# EAGLE design WeatherStation_Rev2 (EAGLE 5.07)
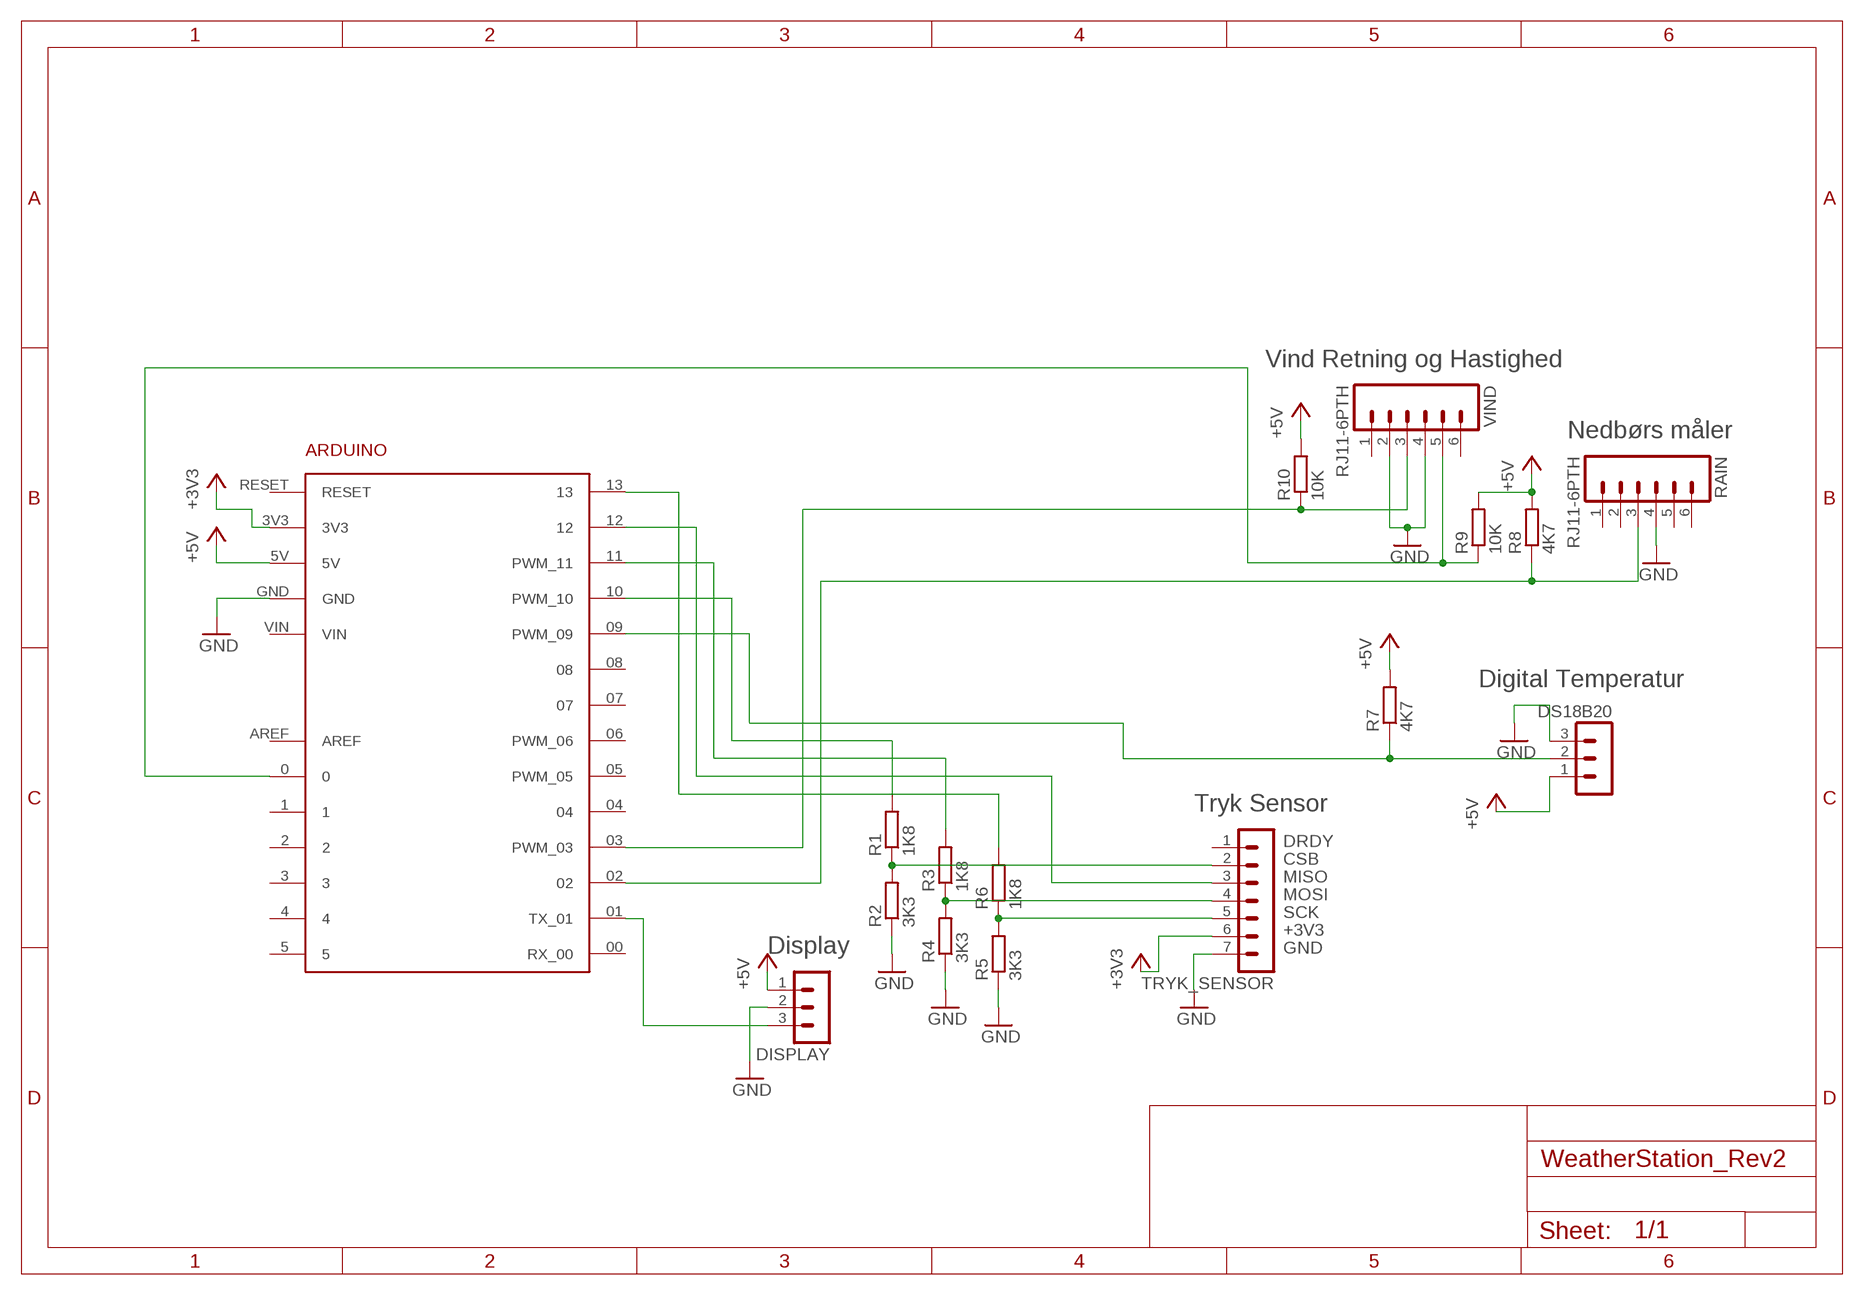
[diagram p0: schematic, sheet 1]

## Parts
ARDUINO1  ARDUINO  [ARDUINO]
DISPLAY  MA03-1  [MA03-1]
DS18B20  MA03-1  [MA03-1]
R1  1K8  R-EU_0207/10  [0207/10]
R2  3K3  R-EU_0207/10  [0207/10]
R3  1K8  R-EU_0207/10  [0207/10]
R4  3K3  R-EU_0207/10  [0207/10]
R5  3K3  R-EU_0207/10  [0207/10]
R6  1K8  R-EU_0207/10  [0207/10]
R7  4K7  R-EU_0207/10  [0207/10]
R8  4K7  R-EU_0207/10  [0207/10]
R9  10K  R-EU_0207/10  [0207/10]
R10  10K  R-EU_0207/10  [0207/10]
RAIN  RJ11-6PTH  [RJ11-6]
TRYK_SENSOR  MA07-1  [MA07-1]
VIND  RJ11-6PTH  [RJ11-6]

## Nets
+3V3: ARDUINO1.3V3 TRYK_SENSOR.6
+5V: ARDUINO1.5V DISPLAY.1 DS18B20.1 R7.2 R8.2 R9.2 R10.2
GND: ARDUINO1.GND DISPLAY.2 DS18B20.3 R2.1 R4.1 R5.1 RAIN.4 TRYK_SENSOR.7 VIND.2 VIND.4
N$1: ARDUINO1.11(PWM_11) R3.2
N$2: R1.1 R2.2 TRYK_SENSOR.2
N$3: ARDUINO1.10(PWM_10) R1.2
N$4: ARDUINO1.12 TRYK_SENSOR.3
N$5: R3.1 R4.2 TRYK_SENSOR.4
N$6: R5.2 R6.1 TRYK_SENSOR.5
N$7: ARDUINO1.13 R6.2
N$8: ARDUINO1.02 R8.1 RAIN.3
N$9: ARDUINO1.09(PWM_09) DS18B20.2 R7.1
N$10: ARDUINO1.0 R9.1 VIND.5
N$11: ARDUINO1.01(TX_01) DISPLAY.3
N$14: ARDUINO1.03(PWM_03) R10.1 VIND.3
Unconnected: ARDUINO1.00(RX_00) ARDUINO1.1 ARDUINO1.2 ARDUINO1.3 ARDUINO1.04 ARDUINO1.4 ARDUINO1.5 ARDUINO1.05(PWM_05) ARDUINO1.06(PWM_06) ARDUINO1.07 ARDUINO1.08 ARDUINO1.AREF ARDUINO1.RESET ARDUINO1.VIN RAIN.1 RAIN.2 RAIN.5 RAIN.6 TRYK_SENSOR.1 VIND.1 VIND.6

## Notes on the sheet
- Vind Retning og Hastighed
- Nedbørs måler
- Digital Temperatur
- Tryk Sensor
- DRDY
- CSB
- MISO
- MOSI
- SCK
- +3V3
- Display | GND

## Library data of the parts
ARDUINO1 = arduino:ARDUINO: For creating Arduino shields
DISPLAY DS18B20 = con-lstb:MA03-1: PIN HEADER
R1-R10 = rcl:R-EU_: RESISTOR, European symbol
RAIN VIND = SparkFun:RJ11-6: RJ11 Jack Simple 6 pin RJ11 jack. Commonly found on CAT3 devices and Microchip programmers. SKU: PRT-00132
TRYK_SENSOR = con-lstb:MA07-1: PIN HEADER

## Board
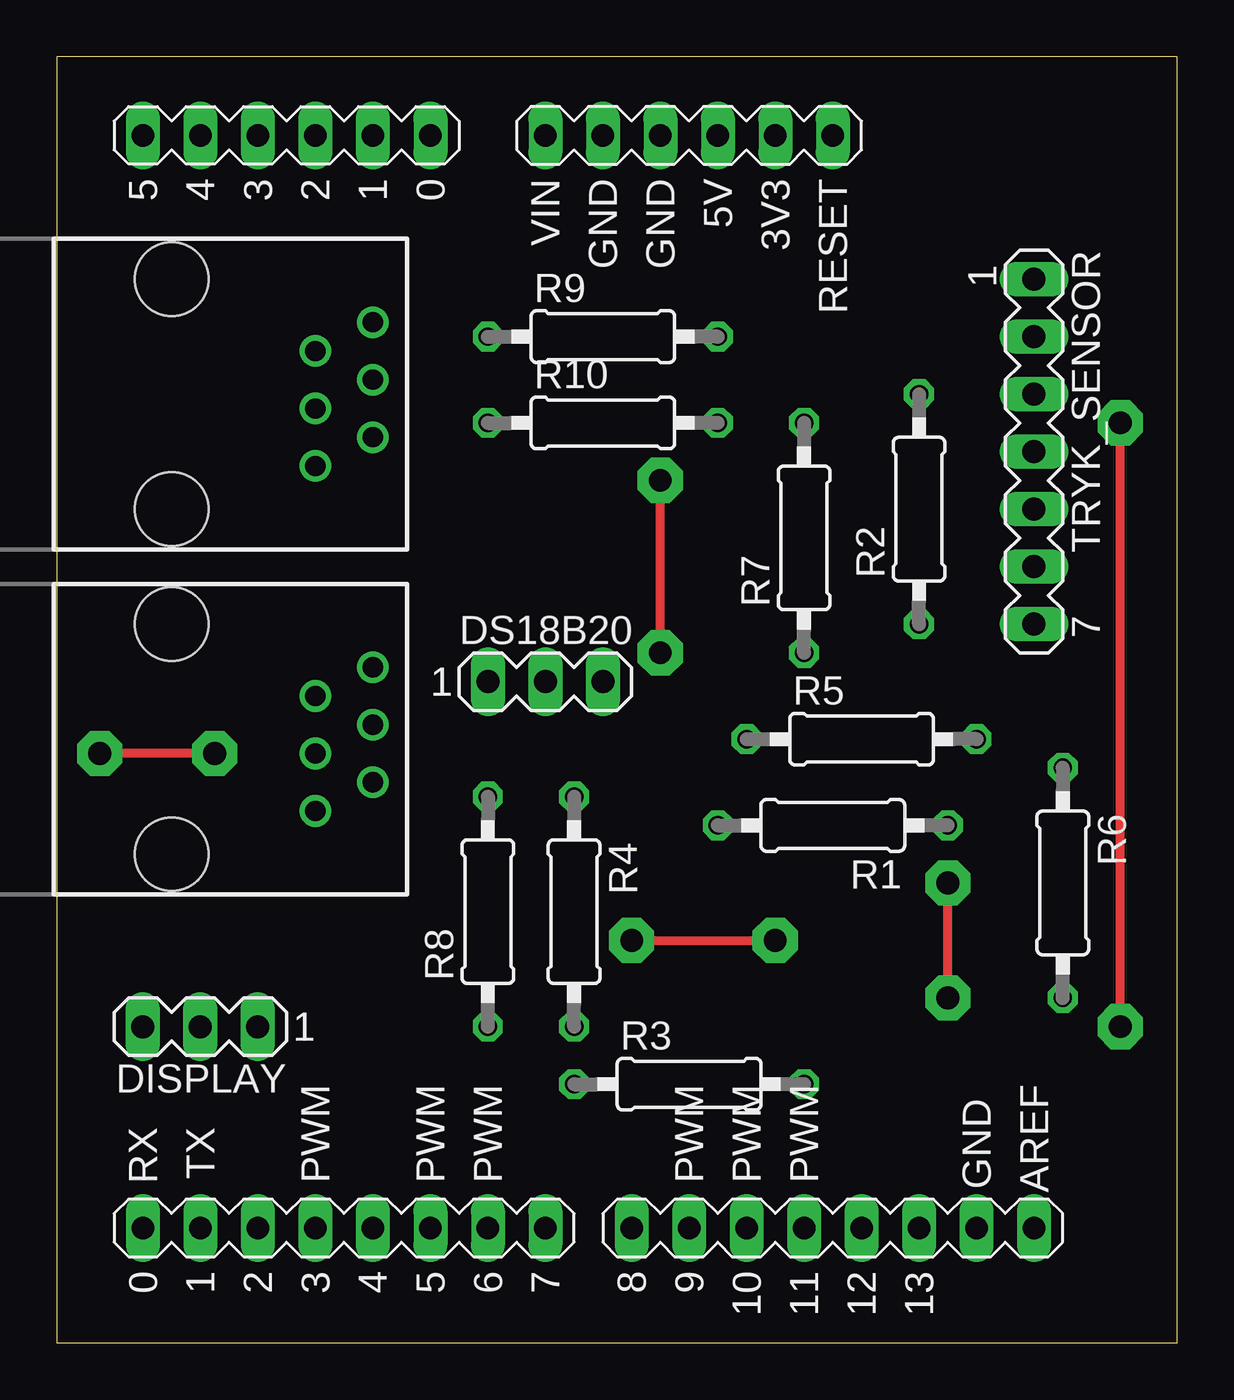
[diagram p1: board, top side]
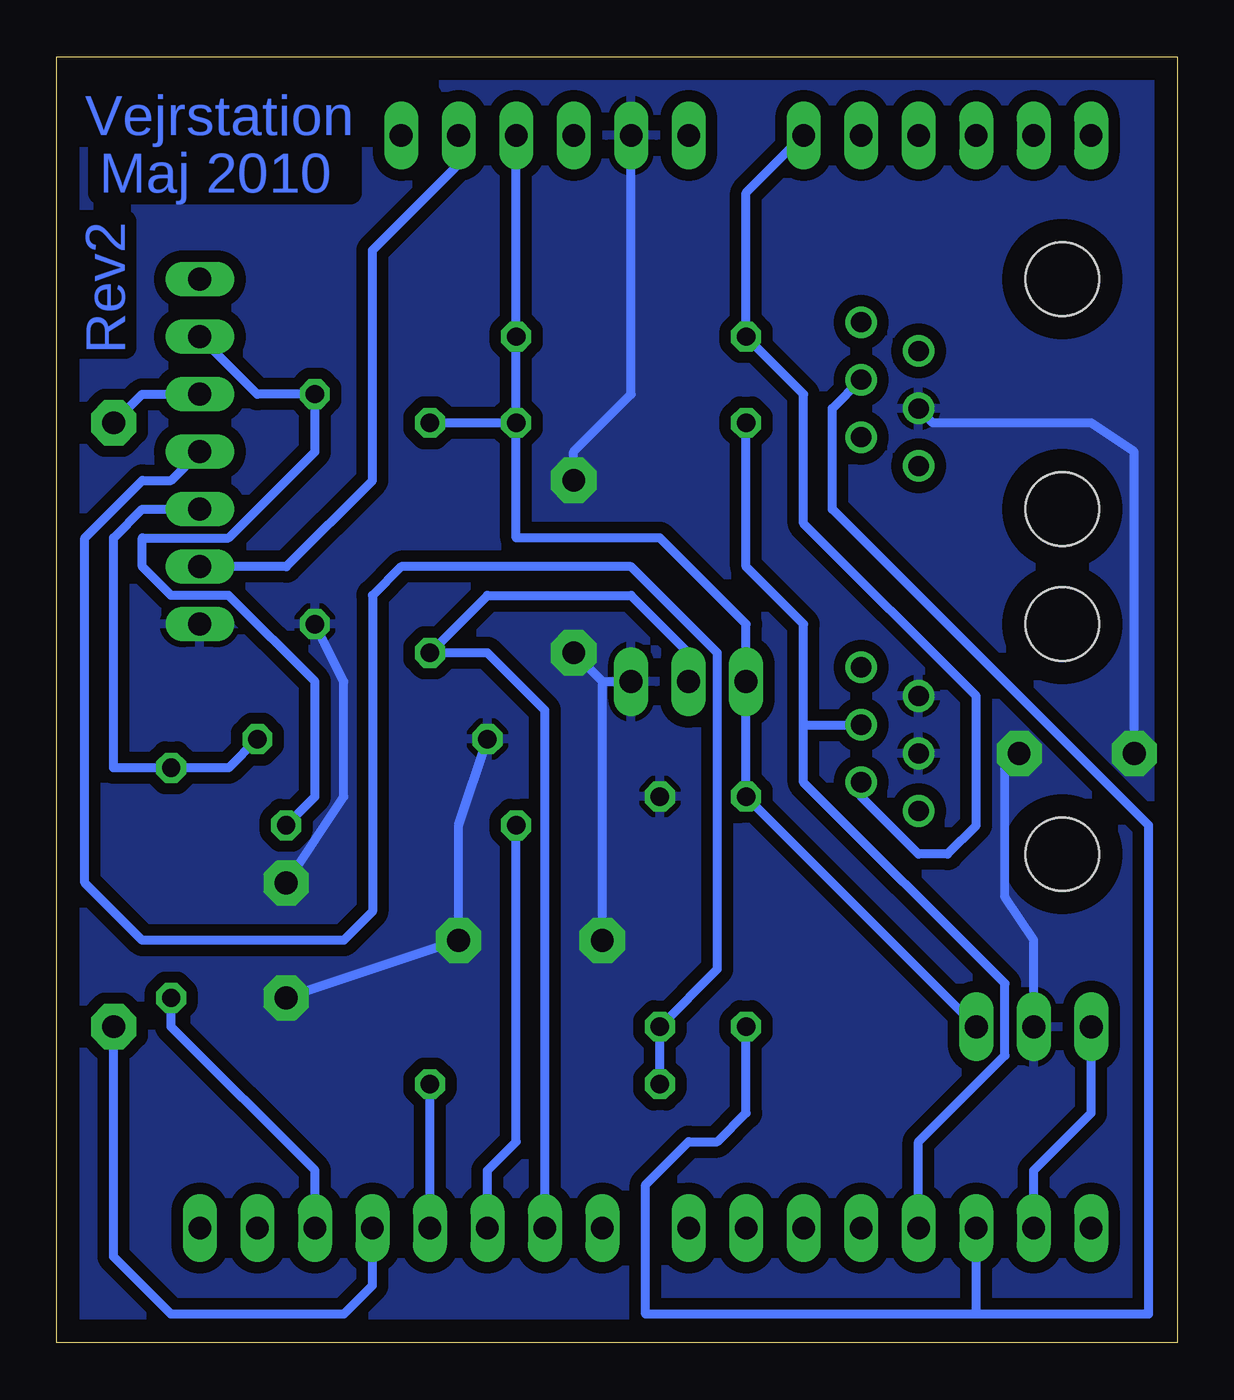
[diagram p2: board, bottom side, seen from below]

Size 49.51 x 56.82 mm. Coordinates in mm from the lower left corner, seen from the top.
Outline: 0,0 49.51,0 49.51,56.82 0,56.82 0,0
Copper layers (1*16): Top 0.035mm / dielectric 1.5mm / Bottom 0.035mm
Design rules "default *": minimum track width 16mil, minimum drill 24mil, track to track 8mil, track to pad 8mil, pad to pad 8mil, via to via 8mil, smd to smd 8mil, copper to edge 40mil, drill to drill 8mil, minimum pad ring 10mil, minimum via ring 8mil, stop-mask expansion 4mil, vias tented up to drill 0mil, thermal gap 10mil

### Footprints (pad centres in the part's own frame; a part is rotated, then mirrored left to right if it is on the bottom)
ARDUINO = drill 1 long: 00 25.4,-20.32; 0 -22.86,-7.62; 01 25.4,-17.78; 1 -22.86,-10.16; 02 25.4,-15.24; 2 -22.86,-12.7; 03 25.4,-12.7; 3 -22.86,-15.24; 3V3 -22.86,7.62; 04 25.4,-10.16; 4 -22.86,-17.78; 05 25.4,-7.62; 5 -22.86,-20.32; 5V -22.86,5.08; 06 25.4,-5.08; 07 25.4,-2.54; 08 25.4,1.27; 09 25.4,3.81; 10 25.4,6.35; 11 25.4,8.89; 12 25.4,11.43; 13 25.4,13.97; AREF 25.4,19.05; GND -22.86,0; GND2 -22.86,2.54; GND3 25.4,16.51; RESET -22.86,10.16; VIN -22.86,-2.54
MA03-1 = drill 1.016 long: 1 -2.54,0; 2 0,0; 3 2.54,0
0207/10 = drill 0.813 octagon: 1 -5.08,0; 2 5.08,0
RJ11-6 = drill 0.889 round: 1 1.905,8.89; 2 3.175,6.35; 3 4.445,8.89; 4 5.715,6.35; 5 6.985,8.89; 6 8.255,6.35 | hole 3.251: 0,0; 10.16,0
MA07-1 = drill 1.016 long: 1 -7.62,0; 2 -5.08,0; 3 -2.54,0; 4 0,0; 5 2.54,0; 6 5.08,0; 7 7.62,0

### Placement (x,y rotation side)
ARDUINO1  24.13,30.48 270 top
DISPLAY  6.35,13.97 180 top
DS18B20  21.59,29.21 0 top
R1  34.29,22.86 180 top
R2  38.1,36.83 90 top
R3  27.94,11.43 0 top
R4  22.86,19.05 270 top
R5  35.56,26.67 0 top
R6  44.45,20.32 270 top
R7  33.02,35.56 90 top
R8  19.05,19.05 90 top
R9  24.13,44.45 0 top
R10  24.13,40.64 0 top
RAIN  5.08,46.99 270 top
TRYK_SENSOR  43.18,39.37 270 top
VIND  5.08,31.75 270 top

### Tracks (layer width: path | path; a pad name or v marks a point on that pad's centre or on a via)
+3V3
  Bottom 0.406: ARDUINO1.3V3 31.75,52.07 35.56,48.26 35.56,38.1 39.37,34.29 TRYK_SENSOR.6
+5V
  Bottom 0.406: R10.2 R9.2 ARDUINO1.5V | R10.2 R7.2 | DISPLAY.1 R8.2 DS18B20.1 19.05,31.75 22.86,35.56 29.21,35.56 R10.2
GND  (via drill 1)
  Top 0.406: v6.99,26.04 v1.91,26.04 | v26.67,30.48 v26.67,38.1 | v25.4,17.78 v31.75,17.78 | v39.37,15.24 v39.37,20.32
  Bottom 0.406: DISPLAY.2 6.35,17.78 7.62,19.68 7.62,25.4 6.35,26.04 v6.99,26.04 | v1.91,26.04 1.91,39.37 3.81,40.64 10.79,40.64 RAIN.4 | 25.4,29.21 DS18B20.3 | 25.4,29.21 v26.67,30.48 | v26.67,38.1 26.67,39.37 24.13,41.91 ARDUINO1.GND | v25.4,17.78 25.4,29.21 | R5.1 31.75,22.86 v31.75,17.78 v39.37,15.24 | v39.37,20.32 36.83,24.13 36.83,29.21 R2.1
  pour Bottom (isolate 0.508): 0,57.15 49.53,57.15 49.53,0 0,0
N$1
  Bottom 0.406: ARDUINO1.11 R3.2
N$2
  Bottom 0.406: R1.1 38.1,24.13 38.1,29.21 41.91,33.02 44.45,33.02 45.72,34.29 45.72,35.56 41.91,35.56 38.1,39.37 R2.2 40.64,41.91 TRYK_SENSOR.2
N$3
  Bottom 0.406: R1.2 29.21,8.89 30.48,7.62 ARDUINO1.10
N$4  (via drill 1)
  Top 0.406: v46.99,13.97 v46.99,40.64
  Bottom 0.406: ARDUINO1.12 35.56,2.54 36.83,1.27 44.45,1.27 46.99,3.81 v46.99,13.97 | v46.99,40.64 45.72,41.91 TRYK_SENSOR.3
N$5
  Bottom 0.406: R3.1 R4.2 20.32,16.51 20.32,30.48 24.13,34.29 34.29,34.29 35.56,33.02 35.56,19.05 36.83,17.78 45.72,17.78 48.26,20.32 48.26,35.56 45.72,38.1 44.45,38.1 TRYK_SENSOR.4
N$6
  Bottom 0.406: R5.2 41.91,25.4 R6.1 46.99,25.4 46.99,35.56 45.72,36.83 TRYK_SENSOR.5
N$7
  Bottom 0.406: R6.2 44.45,13.97 38.1,7.62 ARDUINO1.13
N$8
  Bottom 0.406: R8.1 19.05,10.16 20.32,8.89 21.59,8.89 23.5,6.99 23.5,1.27 8.89,1.27 | 8.89,1.27 ARDUINO1.02 | RAIN.3 15.24,41.27 15.24,36.83 1.27,22.86 1.27,1.27 8.89,1.27
N$9
  Bottom 0.406: DS18B20.2 21.59,30.48 24.13,33.02 30.48,33.02 R7.1 30.48,30.48 27.94,27.94 ARDUINO1.09
N$10
  Bottom 0.406: ARDUINO1.0 19.05,50.8 R9.1 16.51,41.91 16.51,36.2 8.89,28.57 8.89,22.86 10.16,21.59 11.43,21.59 13.97,24.13 VIND.5
N$11
  Bottom 0.406: ARDUINO1.01 6.35,7.62 3.81,10.16 DISPLAY.3
N$14
  Bottom 0.406: R10.1 19.05,34.29 16.51,31.75 16.51,27.3 | 16.51,27.3 VIND.3 | 16.51,27.3 16.51,24.77 7.62,15.88 7.62,12.7 11.43,8.89 ARDUINO1.03

### Text on the board
Bottom: Vejrstation | Maj 2010 | Rev2